# Altium schematic sheet RADC-Microcontroller-S02-V00.SchDoc: RADC Microcontroller (STM32F446ZC, 144LQFP)
size A3; DrawnBy: Jonn Dillon; DocumentNumber: 3; SheetNumber: 3; SheetTotal: 8; Version: 00; Project: QUTMS RADIO COMPUTE; PageSetup: Record=PageOptions|CenterHorizontal=True|CenterVertical=True|PrintScale=0.97|XCorrection=1.00|YCorrection=1.00|PrintKind=0|BorderSize=5000000|LeftOffset=0|BottomOffset=0|Orientation=2|PaperLength=1000|PaperWidth=1000|Scale=100|PaperSource=7|PrintQuality=-4|MediaType=1|DitherType=10|PaperKind=A4|PrintScaleMode=1
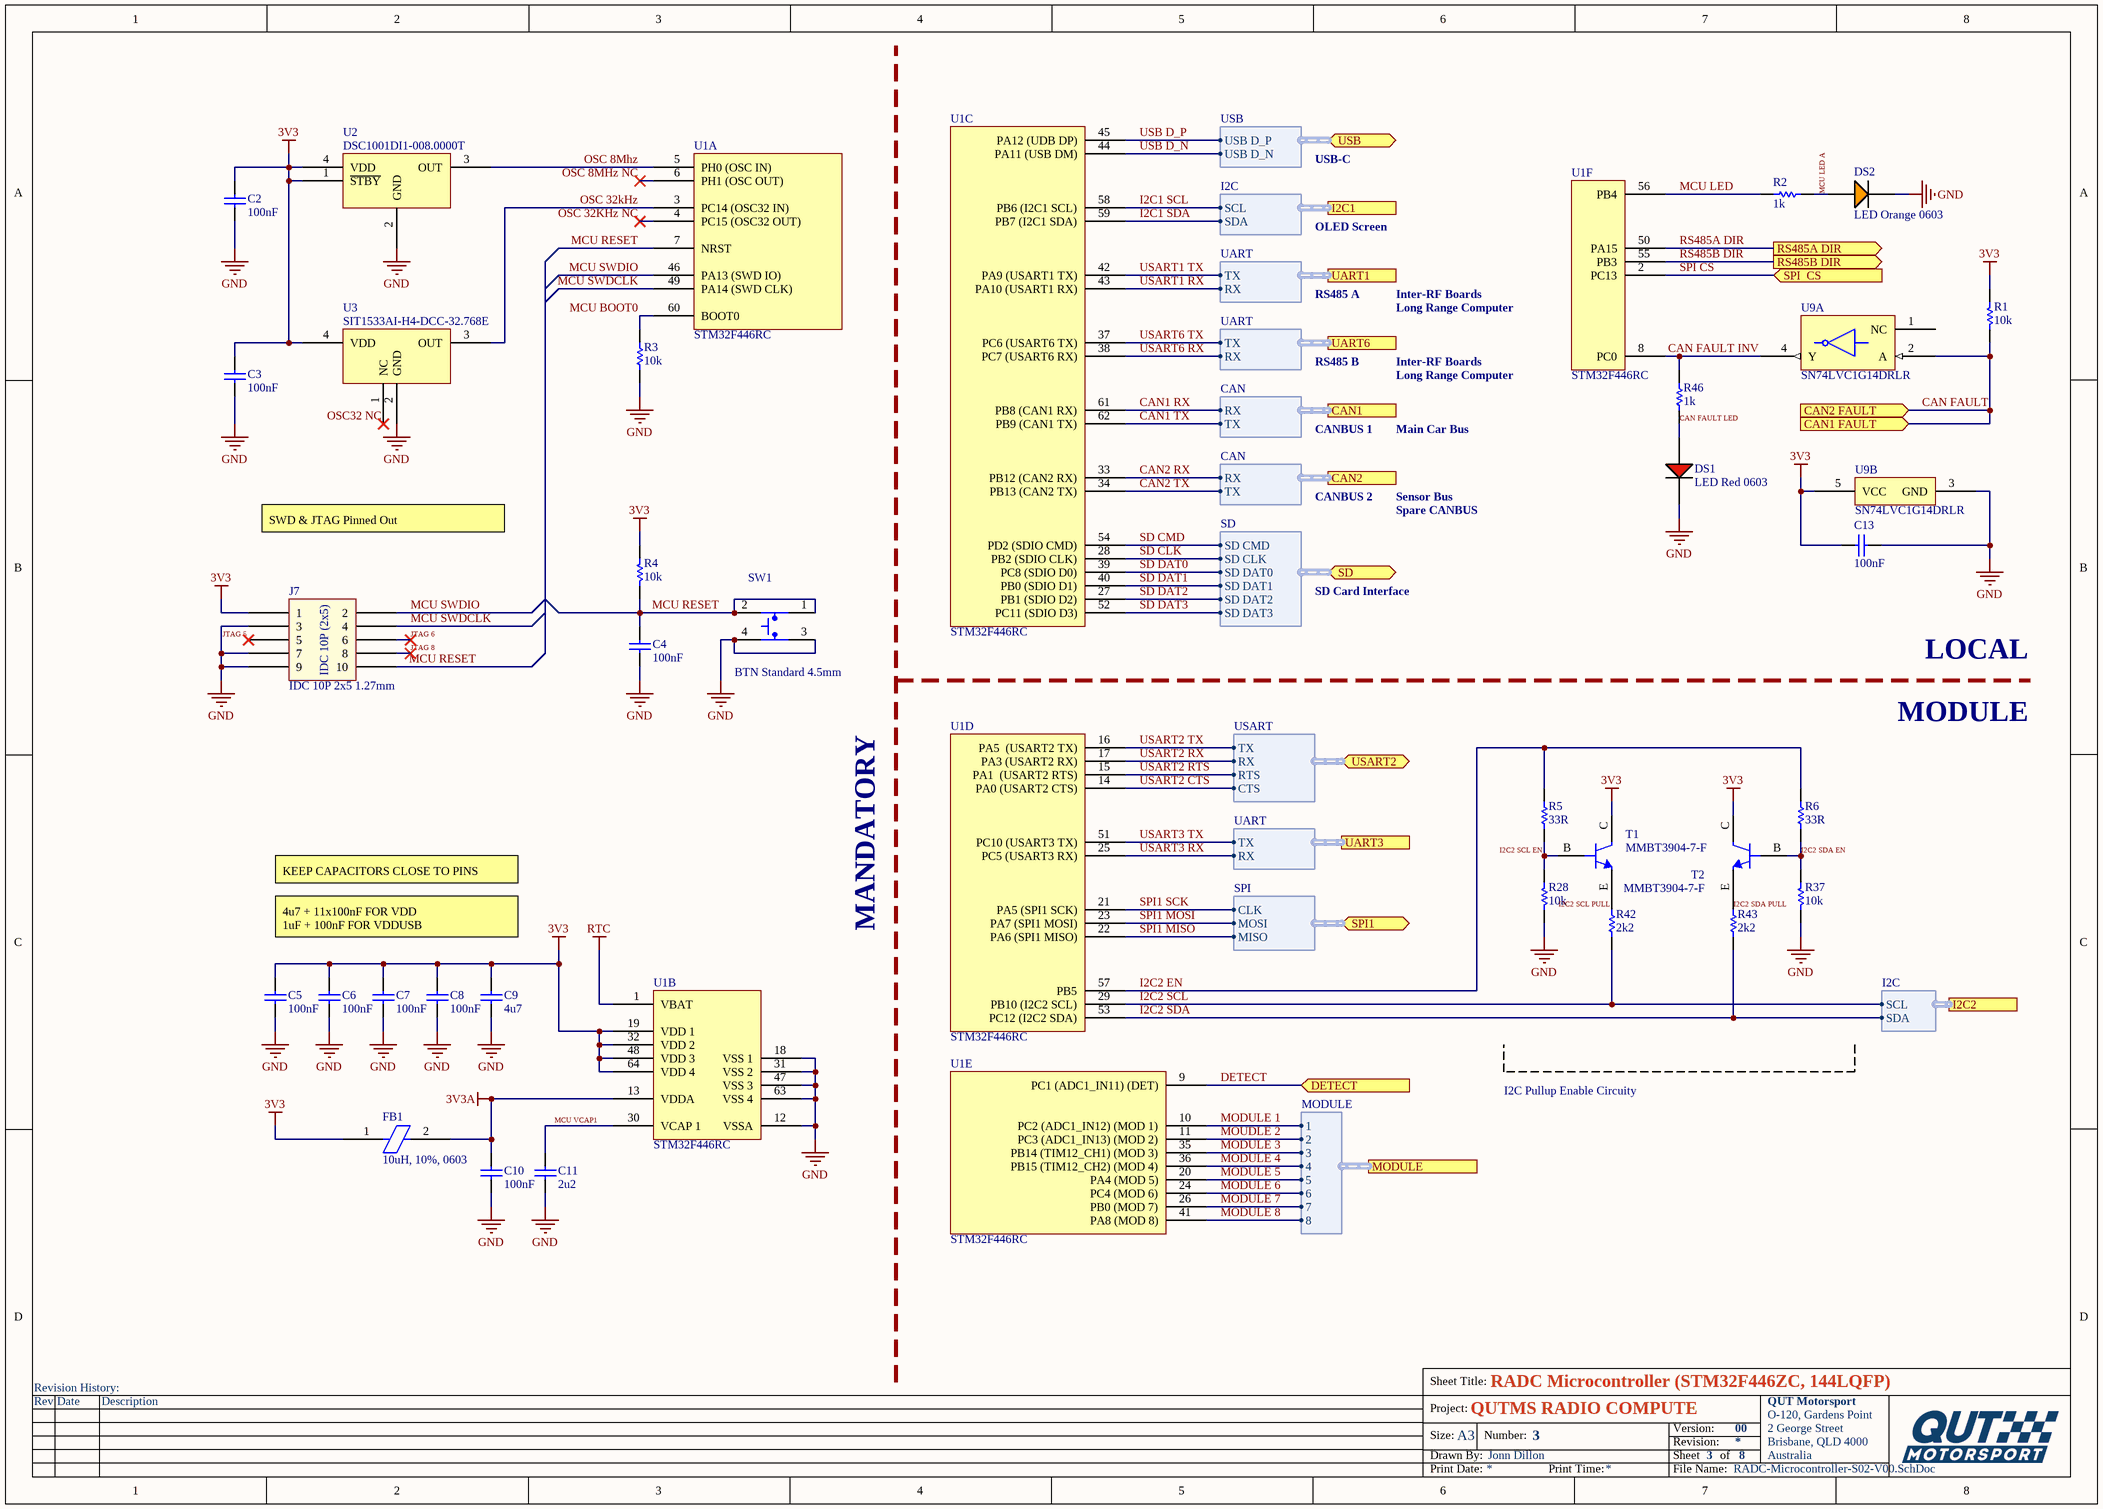
[diagram p0: RADC-Microcontroller-S02-V00.SchDoc]

## Parts
C2  100nF  [Cap_Ceramic_0603]
C3  100nF  [Cap_Ceramic_0603]
C4  100nF  [Cap_Ceramic_0603]
C5  100nF  [Cap_Ceramic_0603]
C6  100nF  [Cap_Ceramic_0603]
C7  100nF  [Cap_Ceramic_0603]
C8  100nF  [Cap_Ceramic_0603]
C9  4u7  [Cap_Ceramic_0603]
C10  100nF  [Cap_Ceramic_0603]
C11  2u2  [Cap_Ceramic_0603]
C13  100nF  [Cap_Ceramic_0603]
DS1  LED Red 0603  [LED RED 0603]
DS2  LED Orange 0603  [LED ORANGE 0603]
FB1  10uH, 10%, 0603  [Inductor_0603]
J7  IDC 10P 2x5 1.27mm  [IDC 1.27MM 10P]
R1  10k  [Res_ThinFilm_0603]
R2  1k  [Res_ThinFilm_0603]
R3  10k  [Res_ThinFilm_0603]
R4  10k  [Res_ThinFilm_0603]
R5  33R  [Res_ThinFilm_0603]
R6  33R  [Res_ThinFilm_0603]
R28  10k  [Res_ThinFilm_0603]
R37  10k  [Res_ThinFilm_0603]
R42  2k2  [Res_ThinFilm_0603]
R43  2k2  [Res_ThinFilm_0603]
R46  1k  [Res_ThinFilm_0603]
SW1  BTN Standard 4.5mm  [BTN STANDARD 4.5mm X 4.5mm]
T1  MMBT3904-7-F  [SOT23-3 - Transistor]
T2  MMBT3904-7-F  [SOT23-3 - Transistor]
U1  STM32F446RC  [STM-LQFP64_V]  (parts A,B,C,D,E,F of 6)
U2  DSC1001DI1-008.0000T  [DSC1001DI1-008.0000TCT-ND]
U3  SIT1533AI-H4-DCC-32.768E  [SIT1533AI-H4-DCC-32.768E]
U9  SN74LVC1G14DRLR  [SOT-553]  (parts A,B of 2)

## Ports
CAN1 (harness CAN), CAN1 FAULT (in), CAN2 (harness CAN), CAN2 FAULT (in), DETECT (in), I2C1 (harness I2C), I2C2 (harness I2C), MODULE (harness MODULE), RS485A DIR (out), RS485B DIR (out), SD (bidir, harness SD), SPI1 (bidir, harness SPI), SPI  CS (in), UART1 (harness UART), UART3 (harness UART), UART6 (harness UART), USART2 (bidir, harness USART), USB (bidir, harness USB)

## Harnesses
USB: USB D_P, USB D_N
CAN: RX, TX
SD: SD DAT2, SD DAT3, SD CMD, SD CLK, SD DAT0, SD DAT1
SPI: MISO, MOSI, CLK
UART: TX, RX
USART: TX, RX, RTS, CTS
I2C: SDA, SCL
MODULE: 1, 2, 3, 4, 5, 6, 7, 8

## Nets
3V3: C2.2 C3.2 C5.2 C6.2 C7.2 C8.2 C9.2 C13.2 FB1.1 J7.1 R1.2 R4.2 T1.C T2.C U1.19(VDD_1) U1.32(VDD_2) U1.48(VDD_3) U1.64(VDD_4) U2.1(~{STBY}) U2.4(VDD) U3.4(VDD) U9.5(VCC)
3V3A: C10.2 FB1.2 U1.13(VDDA)
GND: C2.1 C3.1 C4.1 C5.1 C6.1 C7.1 C8.1 C9.1 C10.1 C11.1 C13.1 DS1.2(C) DS2.2(C) J7.3 J7.7 J7.9 R3.1 R28.1 R37.1 SW1.3 SW1.4 U1.12(VSSA) U1.18(VSS_1) U1.31(VSS_2) U1.47(VSS_3) U1.63(VSS_4) U2.2(GND) U3.2(GND) U9.3(GND)
RTC: U1.1(VBAT)
CAN1 RX: U1.61(PB8_(CAN1_RX)) ; port CAN1.RX
CAN1 TX: U1.62(PB9_(CAN1_TX)) ; port CAN1.TX
CAN2 RX: U1.33(PB12_(CAN2_RX)) ; port CAN2.RX
CAN2 TX: U1.34(PB13_(CAN2_TX)) ; port CAN2.TX
CAN FAULT: R1.1 U9.2(A) ; port CAN1 FAULT, port CAN2 FAULT
CAN FAULT INV: R46.2 U1.8(PC0) U9.4(Y)
CAN FAULT LED: DS1.1(A) R46.1
DETECT: U1.9(PC1_(ADC1_IN11)_(DET)) ; port DETECT
I2C1 SCL: U1.58(PB6_(I2C1_SCL)) ; port I2C1.SCL
I2C1 SDA: U1.59(PB7_(I2C1_SDA)) ; port I2C1.SDA
I2C2 EN: R5.2 R6.2 U1.57(PB5)
I2C2 SCL: R42.1 U1.29(PB10_(I2C2_SCL)) ; port I2C2.SCL
I2C2 SCL EN: R5.1 R28.2 T1.B
I2C2 SDA: R43.1 U1.53(PC12_(I2C2_SDA)) ; port I2C2.SDA
I2C2 SDA EN: R6.1 R37.2 T2.B
JTAG 5: J7.5
JTAG 6: J7.6
JTAG 8: J7.8
MCU BOOT0: R3.2 U1.60(BOOT0)
MCU LED: R2.2 U1.56(PB4)
MCU LED A: DS2.1(A) R2.1
MCU RESET: C4.2 J7.10 R4.1 SW1.1 SW1.2 U1.7(NRST)
MCU SWDCLK: J7.4 U1.49(PA14_(SWD_CLK))
MCU SWDIO: J7.2 U1.46(PA13_(SWD_IO))
MCU VCAP1: C11.2 U1.30(VCAP_1)
MODULE 1: U1.10(PC2_(ADC1_IN12)_(MOD_1)) ; port MODULE.1
MODULE 3: U1.35(PB14_(TIM12_CH1)_(MOD_3)) ; port MODULE.3
MODULE 4: U1.36(PB15_(TIM12_CH2)_(MOD_4)) ; port MODULE.4
MODULE 5: U1.20(PA4_(MOD_5)) ; port MODULE.5
MODULE 6: U1.24(PC4_(MOD_6)) ; port MODULE.6
MODULE 7: U1.26(PB0_(MOD_7)) ; port MODULE.7
MODULE 8: U1.41(PA8_(MOD_8)) ; port MODULE.8
MOUDLE 2: U1.11(PC3_(ADC1_IN13)_(MOD_2)) ; port MODULE.2
OSC32 NC: U3.1(NC)
OSC 8Mhz: U1.5(PH0_(OSC_IN)) U2.3(OUT)
OSC 8MHz NC: U1.6(PH1_(OSC_OUT))
OSC 32kHz: U1.3(PC14_(OSC32_IN)) U3.3(OUT)
OSC 32KHz NC: U1.4(PC15_(OSC32_OUT))
RS485A DIR: U1.50(PA15) ; port RS485A DIR
RS485B DIR: U1.55(PB3) ; port RS485B DIR
SD CLK: U1.28(PB2_(SDIO_CLK)) ; port SD.SD CLK
SD CMD: U1.54(PD2_(SDIO_CMD)) ; port SD.SD CMD
SD DAT0: U1.39(PC8_(SDIO_D0)) ; port SD.SD DAT0
SD DAT1: U1.40(PB0_(SDIO_D1)) ; port SD.SD DAT1
SD DAT2: U1.27(PB1_(SDIO_D2)) ; port SD.SD DAT2
SD DAT3: U1.52(PC11_(SDIO_D3)) ; port SD.SD DAT3
SPI1 MISO: U1.22(PA6_(SPI1_MISO)) ; port SPI1.MISO
SPI1 MOSI: U1.23(PA7_(SPI1_MOSI)) ; port SPI1.MOSI
SPI1 SCK: U1.21(PA5_(SPI1_SCK)) ; port SPI1.CLK
SPI CS: U1.2(PC13) ; port SPI  CS
USART1 RX: U1.43(PA10_(USART1_RX)) ; port UART1.RX
USART1 TX: U1.42(PA9_(USART1_TX)) ; port UART1.TX
USART2 CTS: U1.14(PA0_(USART2_CTS)) ; port USART2.CTS
USART2 RTS: U1.15(PA1__(USART2_RTS)) ; port USART2.RTS
USART2 RX: U1.17(PA3_(USART2_RX)) ; port USART2.RX
USART2 TX: U1.16(PA5__(USART2_TX)) ; port USART2.TX
USART3 RX: U1.25(PC5_(USART3_RX)) ; port UART3.RX
USART3 TX: U1.51(PC10_(USART3_TX)) ; port UART3.TX
USART6 RX: U1.38(PC7_(USART6_RX)) ; port UART6.RX
USART6 TX: U1.37(PC6_(USART6_TX)) ; port UART6.TX
USB D_N: U1.44(PA11_(USB_DM)) ; port USB.USB D_N
USB D_P: U1.45(PA12_(UDB_DP)) ; port USB.USB D_P
NetR42_2: R42.2 T1.E
NetR43_2: R43.2 T2.E

Not connected (* = marked no-connect by the designer): U9 1(NC)

## Notes on the sheet
- USB-C
- OLED Screen
- RS485 A
- Inter-RF Boards
- Long Range Computer
- RS485 B
- CANBUS 1
- Main Car Bus
- CANBUS 2
- Sensor Bus
- Spare CANBUS
- SWD & JTAG Pinned Out
- SD Card Interface
- LOCAL
- MODULE
- MANDATORY
- KEEP CAPACITORS CLOSE TO PINS
- 4u7 + 11x100nF FOR VDD
  1uF + 100nF FOR VDDUSB
- I2C Pullup Enable Circuity
- Labels drawn without touching a wire or pin: I2C2 SCL PULL, I2C2 SDA PULL
- Revision History:
- Sheet Title:
- Rev
- Date
- Description
- Project:
- Size:
- Drawn By:
- A3
- Number:
- Revision:
- Sheet
- Version:
- of
- QUT Motorsport
- O-120, Gardens Point
- 2 George Street
- Brisbane, QLD 4000
- Australia
- Print Date:
- Print Time:
- File Name:
- (in symbol IDC 10P 2x5 1.27mm) IDC 10P (2x5)

## Library data of the parts
C2-C8 C10 C13 = 100nF 50V 5% X7R 0603: Capacitor, Ceramic, SMD, 100nF, 50V, 5%, X7R, 0603
C9 = 4u7 50V 5% X7R 0603: Capacitor, Ceramic, SMD, 4u7, 50V, 5%, X7R, 0603
C11 = 2u2 50V 5% X7R 0603: Capacitor, Ceramic, SMD, 2u2, 50V, 5%, X7R, 0603
R1 R3 R4 R28 R37 = 10k 5% 0603: Resistor, SMD, 10k, 0.1W, 5%, 0603
R2 R46 = 1k 5% 0603: Resistor, SMD, 1k, 0.1W, 5%, 0603
R5 R6 = 33R 5% 0603: Resistor, SMD, 33R, 0.1W, 5%, 0603
R42 R43 = 2k2 5% 0603: Resistor, SMD, 2k2, 0.1W, 5%, 0603
SW1 = BTN Standard 4.5mm: Standard 4.5mm X 4.5mm momentary button; ComponentLink1Description: LCSC; ComponentLink1URL: https://lcsc.com/product-detail/Tactile-Switches_BRIGHT-TSA063G50-250_C294565.html
T1 T2 = MMBT3904-7-F: Bipolar (BJT) Transistor NPN 40V 200mA 300MHz 300mW Surface Mount SOT-23-3
U1 = STM32F446RC: ARM® Cortex®-M4 STM32F4 Microcontroller IC 32-Bit 180MHz 256KB (256K x 8) FLASH 64-LQFP (10x10)
U2 = DSC1001DI1-008.0000T: 8MHz XO (Standard) CMOS Oscillator 1.8 ~ 3.3V Standby (Power Down) 4-SMD, No Lead
U3 = SIT1533AI-H4-DCC-32.768E: 32.768kHz XO (Standard) LVCMOS Oscillator 1.5V ~ 3.63V 4-SMD, No Lead
U9 = SN74LVC1G14DRLR: Inverter IC 1 Channel Schmitt Trigger SOT-5
FB1 = 10uH, 10%, 0603: ComponentLink1Description: Digikey; ComponentLink1URL: https://www.digikey.com.au/product-detail/en/w%C3%BCrth-elektronik/74404064221/732-7261-1-ND/5353241; ComponentLink2Description: LCSC A; ComponentLink2URL: https://lcsc.com/product-detail/Power-Inductors_Sunlord-SWPA6045S221MT_C91047.html; ComponentLink3Description: LCSC B; ComponentLink3URL: https://lcsc.com/product-detail/Power-Inductors_SXN-Shun-Xiang-Nuo-Elec-SMNR6045-221MT_C467145.html